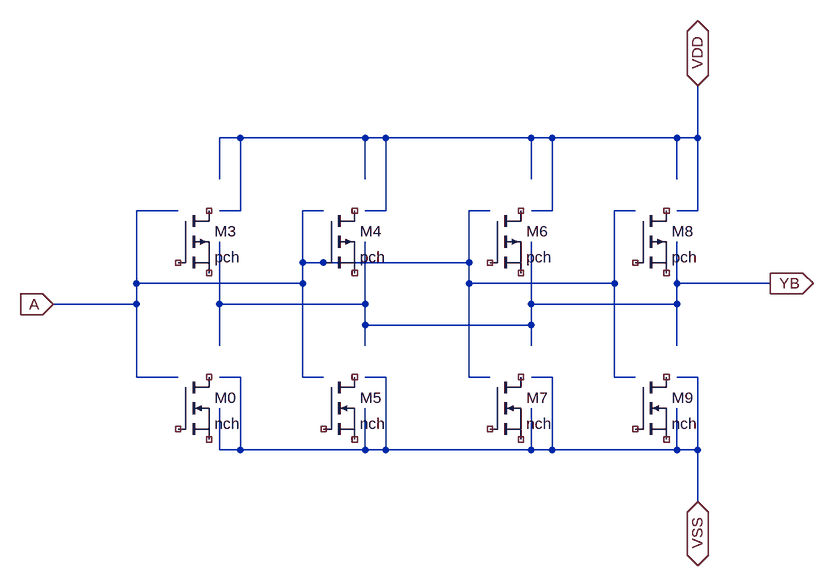
[diagram p0: schematic inv4.asc]
inv4.asc, the LTspice schematic file:
Version 4
SHEET 1 1280 832
WIRE 736 400 960 400
WIRE 736 544 736 400
WIRE 960 400 960 288
WIRE 960 288 992 288
WIRE 960 544 992 544
WIRE 960 544 960 400
WIRE 224 544 224 432
WIRE 480 288 512 288
WIRE 480 544 512 544
WIRE 736 368 736 288
WIRE 480 368 480 288
WIRE 480 368 736 368
WIRE 736 288 768 288
WIRE 736 400 736 368
WIRE 736 544 768 544
WIRE 480 400 480 368
WIRE 224 400 480 400
WIRE 224 432 224 400
WIRE 480 544 480 400
WIRE 96 432 224 432
WIRE 224 288 288 288
WIRE 224 544 288 544
WIRE 224 400 224 288
WIRE 1056 400 1056 336
WIRE 1056 432 1056 400
WIRE 832 432 832 336
WIRE 832 432 1056 432
WIRE 576 464 832 464
WIRE 576 496 576 464
WIRE 832 464 832 432
WIRE 832 496 832 464
WIRE 1056 496 1056 432
WIRE 352 432 352 336
WIRE 352 432 576 432
WIRE 576 432 576 336
WIRE 576 464 576 432
WIRE 1056 400 1200 400
WIRE 352 496 352 432
WIRE 832 176 864 176
WIRE 864 288 864 176
WIRE 832 288 864 288
WIRE 832 240 832 176
WIRE 1056 176 1088 176
WIRE 1088 288 1088 176
WIRE 1056 288 1088 288
WIRE 1056 240 1056 176
WIRE 864 176 1056 176
WIRE 384 176 576 176
WIRE 576 176 608 176
WIRE 608 176 832 176
WIRE 608 288 608 176
WIRE 576 288 608 288
WIRE 576 240 576 176
WIRE 1088 96 1088 176
WIRE 352 176 384 176
WIRE 384 288 384 176
WIRE 352 288 384 288
WIRE 352 240 352 176
WIRE 608 656 832 656
WIRE 864 656 1056 656
WIRE 832 656 864 656
WIRE 864 656 864 544
WIRE 832 544 864 544
WIRE 832 656 832 592
WIRE 1056 656 1088 656
WIRE 1088 656 1088 544
WIRE 1056 544 1088 544
WIRE 1056 656 1056 592
WIRE 384 656 576 656
WIRE 576 656 608 656
WIRE 608 656 608 544
WIRE 576 544 608 544
WIRE 576 656 576 592
WIRE 1088 656 1088 736
WIRE 352 656 384 656
WIRE 384 656 384 544
WIRE 352 544 384 544
WIRE 352 656 352 592
SYMBOL PMOS 992 288 R0
SYMATTR InstName M8
SYMATTR Value pch
SYMATTR Value2 w=6u l=1u
SYMBOL PMOS 768 288 R0
SYMATTR InstName M6
SYMATTR Value pch
SYMATTR Value2 w=6u l=1u
SYMBOL PMOS 512 288 R0
SYMATTR InstName M4
SYMATTR Value pch
SYMATTR Value2 w=6u l=1u
SYMBOL PMOS 288 288 R0
SYMATTR InstName M3
SYMATTR Value pch
SYMATTR Value2 w=6u l=1u
SYMBOL NMOS 992 544 R0
SYMATTR InstName M9
SYMATTR Value nch
SYMATTR Value2 w=2u l=1u
SYMBOL NMOS 768 544 R0
SYMATTR InstName M7
SYMATTR Value nch
SYMATTR Value2 w=2u l=1u
SYMBOL NMOS 512 544 R0
SYMATTR InstName M5
SYMATTR Value nch
SYMATTR Value2 w=2u l=1u
SYMBOL NMOS 288 544 R0
SYMATTR InstName M0
SYMATTR Value nch
SYMATTR Value2 w=2u l=1u
FLAG 1200 400 YB
IOPIN 1200 400 Out
FLAG 1088 736 VSS
IOPIN 1088 736 BiDir
FLAG 1088 96 VDD
IOPIN 1088 96 BiDir
FLAG 96 432 A
IOPIN 96 432 In

The netlist it stands for:
* inv4.asc
* M8: pch w=6u l=1u (symbol PMOS not certain, pin order unknown); nets seen at it: 
* M6: pch w=6u l=1u (symbol PMOS not certain, pin order unknown); nets seen at it: 
* M4: pch w=6u l=1u (symbol PMOS not certain, pin order unknown); nets seen at it: A
* M3: pch w=6u l=1u (symbol PMOS not certain, pin order unknown); nets seen at it: 
* M9: nch w=2u l=1u (symbol NMOS not certain, pin order unknown); nets seen at it: 
* M7: nch w=2u l=1u (symbol NMOS not certain, pin order unknown); nets seen at it: 
* M5: nch w=2u l=1u (symbol NMOS not certain, pin order unknown); nets seen at it: 
* M0: nch w=2u l=1u (symbol NMOS not certain, pin order unknown); nets seen at it: 
.backanno
.end